# Altium project ui_brd_raton_v0.PrjPcb (part 2 of 2)
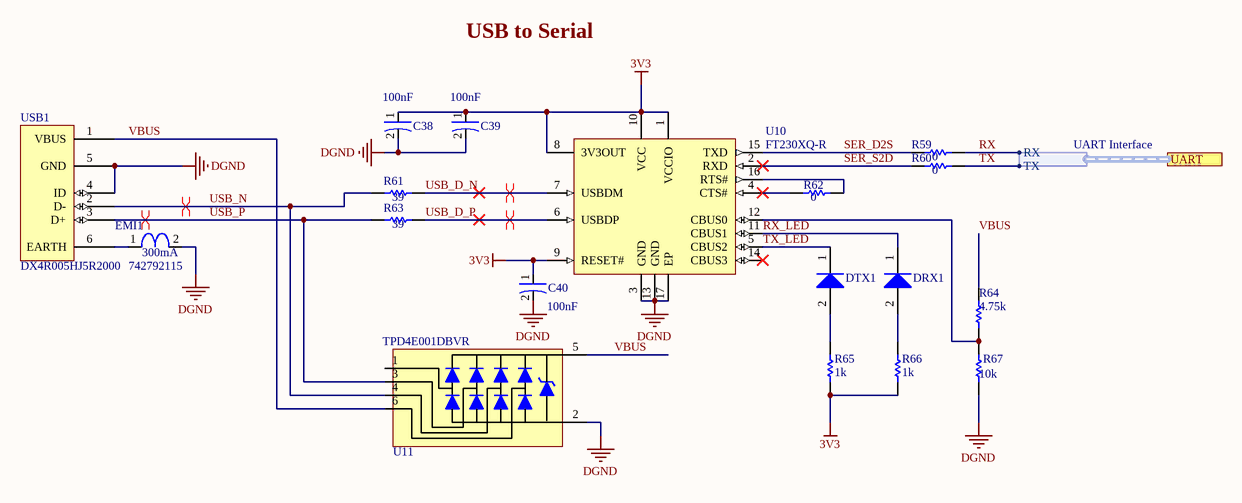
[diagram p7: Communications.SchDoc]

## Nets that join several sheets
3V3: UI Board TOP (J2.18 R68.2 R69.2), Power (7 pins), Microcontroller (84 pins), U_Microcontroller/U_Parametric EQ (6 pins), U_Microcontroller/U_dBFS Meter (17 pins), U_Microcontroller/U_dBFS Meter (17 pins), U_Microcontroller/U_dBFS Meter (17 pins), U_Microcontroller/U_dBFS Meter (17 pins), U_Microcontroller/U_Parametric EQ (6 pins), U_Microcontroller/U_Parametric EQ (6 pins), U_Microcontroller/U_Parametric EQ (6 pins), U_Microcontroller/U_Parametric EQ (6 pins), U_Microcontroller/U_Parametric EQ (6 pins), U_Microcontroller/U_Parametric EQ (6 pins), U_Microcontroller/U_Parametric EQ (6 pins), Communications (9 pins)
DGND: UI Board TOP (5 pins), Power (9 pins), Microcontroller (87 pins), U_Microcontroller/U_Parametric EQ (10 pins), U_Microcontroller/U_dBFS Meter (8 pins), U_Microcontroller/U_dBFS Meter (8 pins), U_Microcontroller/U_dBFS Meter (8 pins), U_Microcontroller/U_dBFS Meter (8 pins), U_Microcontroller/U_Parametric EQ (10 pins), U_Microcontroller/U_Parametric EQ (10 pins), U_Microcontroller/U_Parametric EQ (10 pins), U_Microcontroller/U_Parametric EQ (10 pins), U_Microcontroller/U_Parametric EQ (10 pins), U_Microcontroller/U_Parametric EQ (10 pins), U_Microcontroller/U_Parametric EQ (10 pins), Communications (11 pins)
A0_1: Microcontroller (R3.1 R9.2), U_Microcontroller/U_dBFS Meter (U12_1.38)
A0_2: Microcontroller (R15.1 R19.2), U_Microcontroller/U_dBFS Meter (U12_2.38)
A0_3: Microcontroller (R5.1 R11.2), U_Microcontroller/U_dBFS Meter (U12_3.38)
A0_4: Microcontroller (R17.1 R21.2), U_Microcontroller/U_dBFS Meter (U12_4.38)
A1_1: Microcontroller (R4.1 R10.2), U_Microcontroller/U_dBFS Meter (U12_1.39)
A1_2: Microcontroller (R16.1 R20.2), U_Microcontroller/U_dBFS Meter (U12_2.39)
A1_3: Microcontroller (R6.1 R12.2), U_Microcontroller/U_dBFS Meter (U12_3.39)
A1_4: Microcontroller (R18.1 R22.2), U_Microcontroller/U_dBFS Meter (U12_4.39)
BLUE: Microcontroller (U2.17), U_Microcontroller/U_Parametric EQ (R71_1.1)
BLUE: Microcontroller (U2.18), U_Microcontroller/U_Parametric EQ (R71_2.1)
BLUE: Microcontroller (U2.19), U_Microcontroller/U_Parametric EQ (R71_3.1)
BLUE: Microcontroller (U2.20), U_Microcontroller/U_Parametric EQ (R71_4.1)
BLUE: Microcontroller (U2.21), U_Microcontroller/U_Parametric EQ (R71_5.1)
BLUE: Microcontroller (U2.22), U_Microcontroller/U_Parametric EQ (R71_6.1)
BLUE: Microcontroller (U2.23), U_Microcontroller/U_Parametric EQ (R71_7.1)
BLUE: Microcontroller (U2.24), U_Microcontroller/U_Parametric EQ (R71_8.1)
EQ_Gain: Microcontroller (U5.1), U_Microcontroller/U_Parametric EQ (R77_2.2)
EQ_Gain: Microcontroller (U5.14), U_Microcontroller/U_Parametric EQ (R77_1.2)
EQ_Gain: Microcontroller (U5.4), U_Microcontroller/U_Parametric EQ (R77_3.2)
EQ_Gain: Microcontroller (U8.15), U_Microcontroller/U_Parametric EQ (R77_4.2)
EQ_Gain: Microcontroller (U8.5), U_Microcontroller/U_Parametric EQ (R77_5.2)
EQ_Gain: Microcontroller (U9.12), U_Microcontroller/U_Parametric EQ (R77_7.2)
EQ_Gain: Microcontroller (U9.13), U_Microcontroller/U_Parametric EQ (R77_6.2)
EQ_Gain: Microcontroller (U9.2), U_Microcontroller/U_Parametric EQ (R77_8.2)
Frequency: Microcontroller (U5.12), U_Microcontroller/U_Parametric EQ (R76_2.2)
Frequency: Microcontroller (U5.13), U_Microcontroller/U_Parametric EQ (R76_1.2)
Frequency: Microcontroller (U5.2), U_Microcontroller/U_Parametric EQ (R76_3.2)
Frequency: Microcontroller (U8.1), U_Microcontroller/U_Parametric EQ (R76_5.2)
Frequency: Microcontroller (U8.14), U_Microcontroller/U_Parametric EQ (R76_4.2)
Frequency: Microcontroller (U8.4), U_Microcontroller/U_Parametric EQ (R76_6.2)
Frequency: Microcontroller (U9.15), U_Microcontroller/U_Parametric EQ (R76_7.2)
Frequency: Microcontroller (U9.5), U_Microcontroller/U_Parametric EQ (R76_8.2)
Gain: Microcontroller (U5.15), U_Microcontroller/U_Parametric EQ (R78_1.2)
Gain: Microcontroller (U5.5), U_Microcontroller/U_Parametric EQ (R78_2.2)
Gain: Microcontroller (U8.12), U_Microcontroller/U_Parametric EQ (R78_4.2)
Gain: Microcontroller (U8.13), U_Microcontroller/U_Parametric EQ (R78_3.2)
Gain: Microcontroller (U8.2), U_Microcontroller/U_Parametric EQ (R78_5.2)
Gain: Microcontroller (U9.1), U_Microcontroller/U_Parametric EQ (R78_7.2)
Gain: Microcontroller (U9.14), U_Microcontroller/U_Parametric EQ (R78_6.2)
Gain: Microcontroller (U9.4), U_Microcontroller/U_Parametric EQ (R78_8.2)
MCU_RX: UI Board TOP (P3.1 SW11.16), Microcontroller (U4.43)
MCU_TX: UI Board TOP (P3.3 SW11.14), Microcontroller (U4.44)
Mute: Microcontroller (U7.1), U_Microcontroller/U_Parametric EQ (C42_1.1 R70_1.2 SW12_1.1)
Mute: Microcontroller (U7.4), U_Microcontroller/U_Parametric EQ (C42_2.1 R70_2.2 SW12_2.1)
Mute: Microcontroller (U7.7), U_Microcontroller/U_Parametric EQ (C42_3.1 R70_3.2 SW12_3.1)
Mute: Microcontroller (U7.10), U_Microcontroller/U_Parametric EQ (C42_4.1 R70_4.2 SW12_4.1)
Mute: Microcontroller (U7.13), U_Microcontroller/U_Parametric EQ (C42_5.1 R70_5.2 SW12_5.1)
Mute: Microcontroller (U7.16), U_Microcontroller/U_Parametric EQ (C42_6.1 R70_6.2 SW12_6.1)
Mute: Microcontroller (U7.19), U_Microcontroller/U_Parametric EQ (C42_7.1 R70_7.2 SW12_7.1)
Mute: Microcontroller (U7.22), U_Microcontroller/U_Parametric EQ (C42_8.1 R70_8.2 SW12_8.1)
RX: UI Board TOP (SW11.1 SW11.2), Communications (R59.2)
SCL: UI Board TOP (J2.16 P3.5 R69.1), Microcontroller (R48.1 U2.29 U4.23 U7.29), U_Microcontroller/U_dBFS Meter (U12_1.42), U_Microcontroller/U_dBFS Meter (U12_2.42), U_Microcontroller/U_dBFS Meter (U12_3.42), U_Microcontroller/U_dBFS Meter (U12_4.42)
SDA: UI Board TOP (J2.15 P3.6 R68.1), Microcontroller (R46.1 U2.30 U4.24 U7.30), U_Microcontroller/U_dBFS Meter (U12_1.41), U_Microcontroller/U_dBFS Meter (U12_2.41), U_Microcontroller/U_dBFS Meter (U12_3.41), U_Microcontroller/U_dBFS Meter (U12_4.41)
Select: Microcontroller (U7.3), U_Microcontroller/U_Parametric EQ (C44_1.1 R75_1.2 SW14_1.1)
Select: Microcontroller (U7.6), U_Microcontroller/U_Parametric EQ (C44_2.1 R75_2.2 SW14_2.1)
Select: Microcontroller (U7.9), U_Microcontroller/U_Parametric EQ (C44_3.1 R75_3.2 SW14_3.1)
Select: Microcontroller (U7.12), U_Microcontroller/U_Parametric EQ (C44_4.1 R75_4.2 SW14_4.1)
Select: Microcontroller (U7.15), U_Microcontroller/U_Parametric EQ (C44_5.1 R75_5.2 SW14_5.1)
Select: Microcontroller (U7.18), U_Microcontroller/U_Parametric EQ (C44_6.1 R75_6.2 SW14_6.1)
Select: Microcontroller (U7.21), U_Microcontroller/U_Parametric EQ (C44_7.1 R75_7.2 SW14_7.1)
Select: Microcontroller (U7.24), U_Microcontroller/U_Parametric EQ (C44_8.1 R75_8.2 SW14_8.1)
Solo: Microcontroller (U7.2), U_Microcontroller/U_Parametric EQ (C43_1.1 R73_1.2 SW13_1.1)
Solo: Microcontroller (U7.5), U_Microcontroller/U_Parametric EQ (C43_2.1 R73_2.2 SW13_2.1)
Solo: Microcontroller (U7.8), U_Microcontroller/U_Parametric EQ (C43_3.1 R73_3.2 SW13_3.1)
Solo: Microcontroller (U7.11), U_Microcontroller/U_Parametric EQ (C43_4.1 R73_4.2 SW13_4.1)
Solo: Microcontroller (U7.14), U_Microcontroller/U_Parametric EQ (C43_5.1 R73_5.2 SW13_5.1)
Solo: Microcontroller (U7.17), U_Microcontroller/U_Parametric EQ (C43_6.1 R73_6.2 SW13_6.1)
Solo: Microcontroller (U7.20), U_Microcontroller/U_Parametric EQ (C43_7.1 R73_7.2 SW13_7.1)
Solo: Microcontroller (U7.23), U_Microcontroller/U_Parametric EQ (C43_8.1 R73_8.2 SW13_8.1)
TX: UI Board TOP (SW11.3 SW11.4), Communications (R60.2)